# EAGLE design LB_BIT_i31_OSCILLATOR-v03(5_7)-OHW (EAGLE 6.6.0)
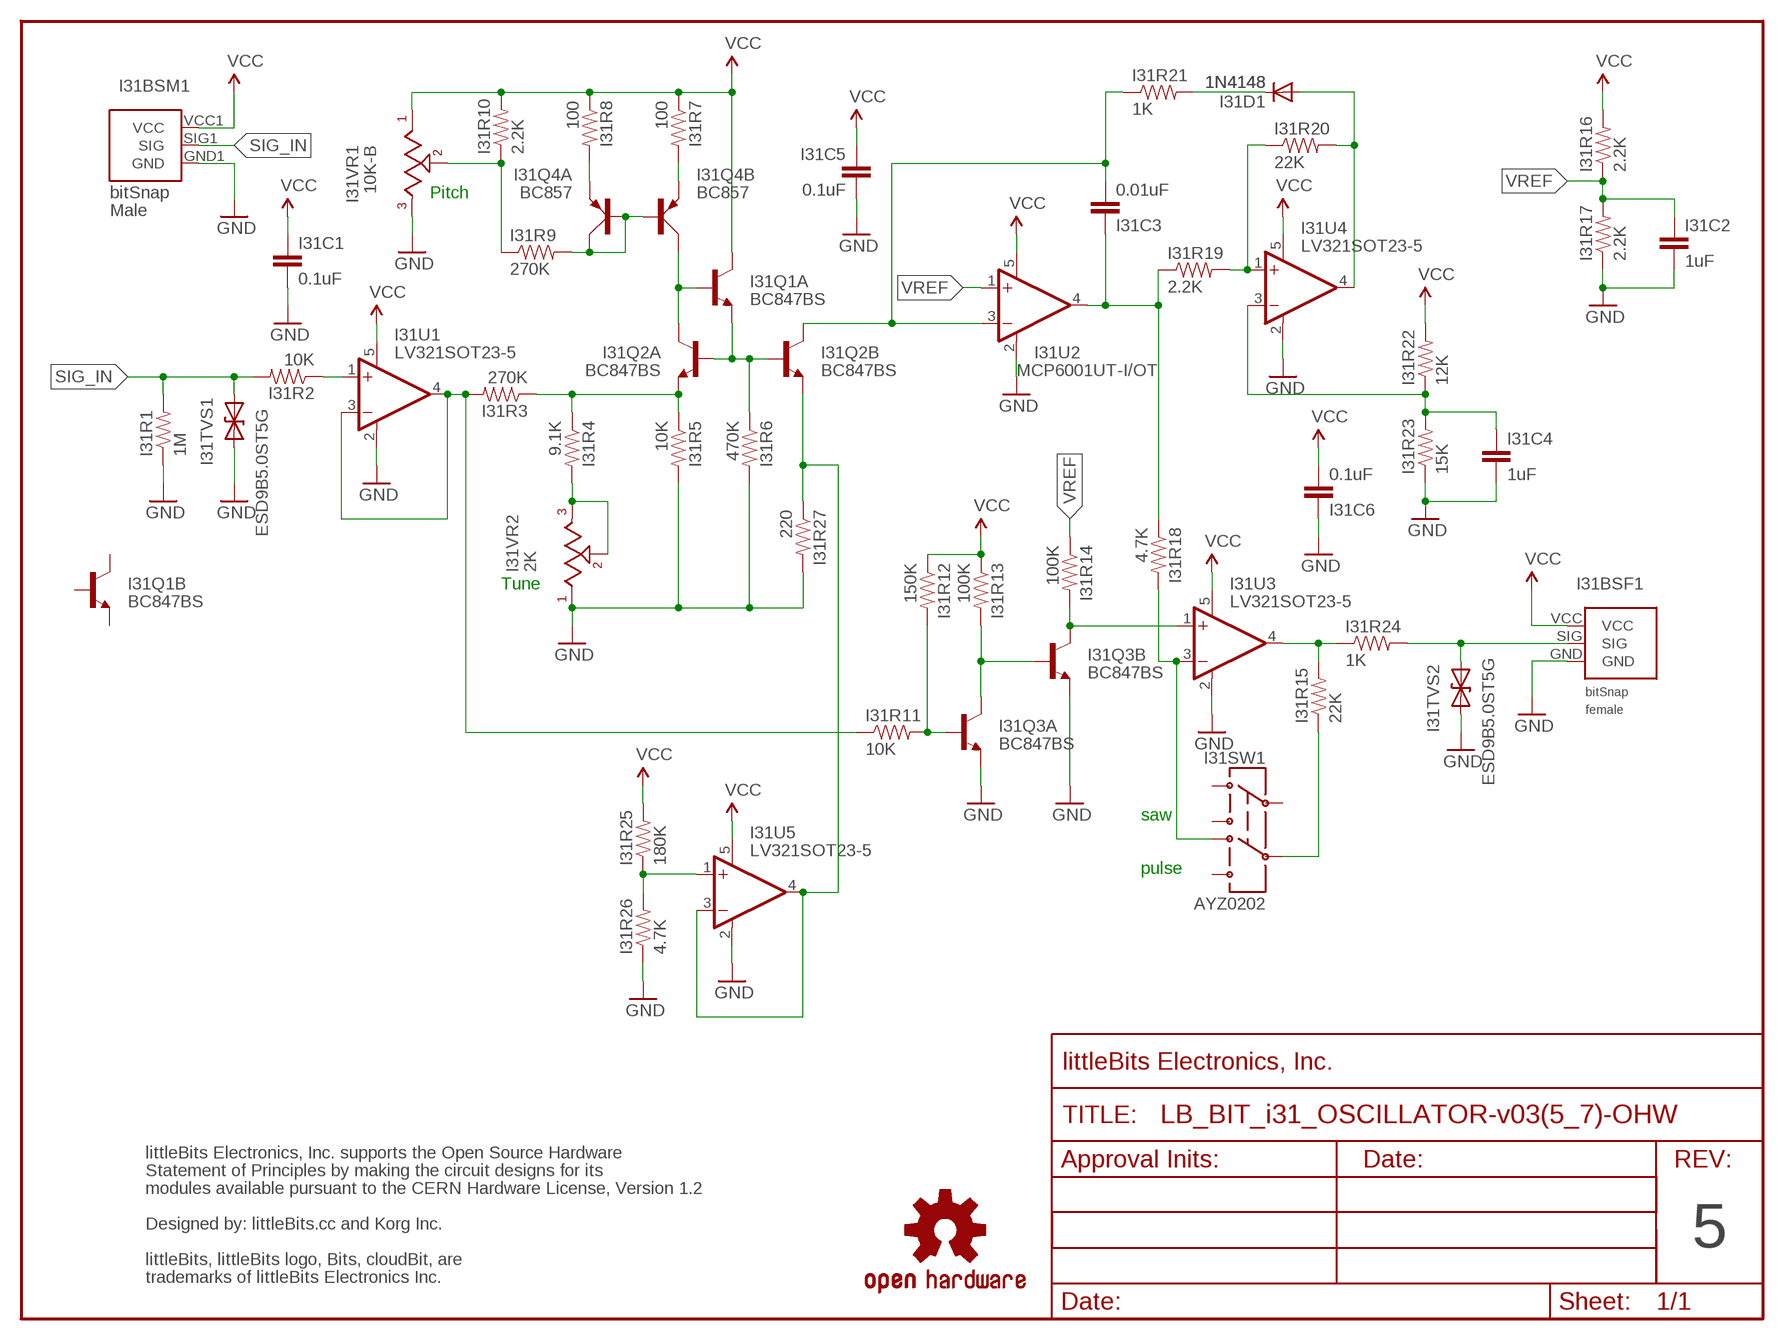
[diagram p0: schematic, sheet 1]

## Parts
I31BSF1  BITSNAP_V03_FEMALE  [BITSNAP_V03_FEMALE]
I31BSM1  BITSNAP_V03_MALE  [BITSNAP_V03_MALE]
I31C1  0.1uF  CAPCAP-0603  [CAP-0603]
I31C2  1uF  CAPCAP-0603  [CAP-0603]
I31C3  0.01uF  CAPCAP-0603  [CAP-0603]
I31C4  1uF  CAPCAP-0603  [CAP-0603]
I31C5  0.1uF  CAPCAP-0603  [CAP-0603]
I31C6  0.1uF  CAPCAP-0603  [CAP-0603]
I31D1  1N4148  DIODESOD  [SOD-323]
I31Q1  BC847BS  TRANS-BJT_NPN-DUAL-BC847BS  [SOT-363_PHILLIPS]
I31Q2  BC847BS  TRANS-BJT_NPN-DUAL-BC847BS  [SOT-363_PHILLIPS]
I31Q3  BC847BS  TRANS-BJT_NPN-DUAL-BC847BS  [SOT-363_PHILLIPS]
I31Q4  BC857  TRANS-BJT_PNP-DUALBC857  [SOT-363_PHILLIPS]
I31R1  1M  RESISTOR0603  [RES-0603]
I31R2  10K  RESISTOR0603  [RES-0603]
I31R3  270K  RESISTOR0603  [RES-0603]
I31R4  9.1K  RESISTOR0603  [RES-0603]
I31R5  10K  RESISTOR0603  [RES-0603]
I31R6  470K  RESISTOR0603  [RES-0603]
I31R7  100  RESISTOR0603  [RES-0603]
I31R8  100  RESISTOR0603  [RES-0603]
I31R9  270K  RESISTOR0603  [RES-0603]
I31R10  2.2K  RESISTOR0603  [RES-0603]
I31R11  10K  RESISTOR0603  [RES-0603]
I31R12  150K  RESISTOR0603  [RES-0603]
I31R13  100K  RESISTOR0603  [RES-0603]
I31R14  100K  RESISTOR0603  [RES-0603]
I31R15  22K  RESISTOR0603  [RES-0603]
I31R16  2.2K  RESISTOR0603  [RES-0603]
I31R17  2.2K  RESISTOR0603  [RES-0603]
I31R18  4.7K  RESISTOR0603  [RES-0603]
I31R19  2.2K  RESISTOR0603  [RES-0603]
I31R20  22K  RESISTOR0603  [RES-0603]
I31R21  1K  RESISTOR0603  [RES-0603]
I31R22  12K  RESISTOR0603  [RES-0603]
I31R23  15K  RESISTOR0603  [RES-0603]
I31R24  1K  RESISTOR0603  [RES-0603]
I31R25  180K  RESISTOR0603  [RES-0603]
I31R26  4.7K  RESISTOR0603  [RES-0603]
I31R27  220  RESISTOR0603  [RES-0603]
I31SW1  AYZ0202  [AYZ0202]
I31TVS1  ESD9B5.0ST5G  DIODE-TVSSOD-923  [SOD-923]
I31TVS2  ESD9B5.0ST5G  DIODE-TVSSOD-923  [SOD-923]
I31U1  LV321SOT23-5  [SOT23-5]
I31U2  MCP6001UT  LV321SOT23-5  [SOT23-5]
I31U3  LV321SOT23-5  [SOT23-5]
I31U4  LV321SOT23-5  [SOT23-5]
I31U5  LV321SOT23-5  [SOT23-5]
I31VR1  10K-B  ALPS_POTTH  [ALPS_POT]
I31VR2  2K  THUMBPOT-BOURNS_3352P  [THUMBPOT-BOURNS_3352]
U$2  FRAME-LETTER-OHWOHW  [FABDWG01-OHW]
U$3  OSHW-LOGOL  [OSHW-LOGO-L]
U$4  OSHWCREDIT-KORG  [OSHWCREDIT-KORG]

## Nets
GND: I31BSF1.GND I31BSM1.GND1(GND) I31C1.2 I31C2.2 I31C4.2 I31C5.2 I31C6.1 I31Q3.1(A:E) I31Q3.4(B:E) I31R1.1 I31R5.2 I31R6.2 I31R17.1 I31R23.1 I31R26.1 I31R27.2 I31TVS1.1(A) I31TVS2.1(A) I31U1.2(V-) I31U2.2(V-) I31U3.2(V-) I31U4.2(V-) I31U5.2(V-) I31VR1.3 I31VR2.3
N$1: I31R4.2 I31VR2.1 I31VR2.2
N$2: I31R3.2 I31R11.1 I31U1.3(-IN) I31U1.4(OUT)
N$3: I31Q1.2(A:B) I31Q2.6(A:C) I31Q4.3(B:C)
N$4: I31R2.1 I31U1.1(+IN)
N$5: I31Q1.1(A:E) I31Q2.2(A:B) I31Q2.5(B:B) I31R6.1
N$6: I31Q4.1(A:E) I31R8.2
N$7: I31Q4.4(B:E) I31R7.2
N$8: I31Q2.1(A:E) I31R3.1 I31R4.1 I31R5.1
N$9: I31R18.2 I31SW1.4 I31U3.3(-IN)
N$10: I31Q3.2(A:B) I31R11.2 I31R12.2
N$11: I31R19.2 I31R20.1 I31U4.1(+IN)
N$12: I31Q4.2(A:B) I31Q4.5(B:B) I31Q4.6(A:C) I31R9.2
N$13: I31R9.1 I31R10.1 I31VR1.2
N$14: I31Q3.5(B:B) I31Q3.6(A:C) I31R13.2
N$15: I31C3.1 I31R18.1 I31R19.1 I31U2.4(OUT)
N$16: I31Q3.3(B:C) I31R14.2 I31U3.1(+IN)
N$17: I31R15.1 I31SW1.5
N$18: I31C3.2 I31Q2.3(B:C) I31R21.1 I31U2.3(-IN)
N$19: I31D1.2(A) I31R20.2 I31U4.4(OUT)
N$20: I31D1.1(C) I31R21.2
N$21: I31R15.2 I31R24.1 I31U3.4(OUT)
N$22: I31C4.1 I31R22.1 I31R23.2 I31U4.3(-IN)
N$23: I31Q2.4(B:E) I31R27.1 I31U5.3(-IN) I31U5.4(OUT)
N$24: I31R25.1 I31R26.2 I31U5.1(+IN)
SIG_IN: I31BSM1.SIG1(SIG) I31R1.2 I31R2.2 I31TVS1.2(C)
SIG_OUT: I31BSF1.SIG I31R24.2 I31TVS2.2(C)
VCC: I31BSF1.VCC I31BSM1.VCC1(VCC) I31C1.1 I31C5.1 I31C6.2 I31Q1.6(A:C) I31R7.1 I31R8.1 I31R10.2 I31R12.1 I31R13.1 I31R16.2 I31R22.2 I31R25.2 I31U1.5(V+) I31U2.5(V+) I31U3.5(V+) I31U4.5(V+) I31U5.5(V+) I31VR1.1
VREF: I31C2.1 I31R14.1 I31R16.1 I31R17.2 I31U2.1(+IN)
Unconnected: I31Q1.3(B:C) I31Q1.4(B:E) I31Q1.5(B:B) I31SW1.1 I31SW1.2 I31SW1.3 I31SW1.6

## Notes on the sheet
- Pitch
- MCP6001UT-I/OT
- Tune
- saw
- pulse
- 5

## Library data of the parts
I31BSF1 = bitSnap:BITSNAP_V03_FEMALE
I31BSM1 = bitSnap:BITSNAP_V03_MALE
I31C1-I31C6 = LITTLEBITS:CAP
I31D1 = LITTLEBITS:DIODE: Diode These are standard reverse protection diodes and small signal diodes. SMA package can handle up to about 1A. SOD-323 can handle about 200mA. What the SOD-323 package when ordering, there are some mfgs out there that are 5-pin packages.
I31Q1-I31Q3 = LITTLEBITS:TRANS-BJT_NPN-DUAL
I31Q4 = LITTLEBITS:TRANS-BJT_PNP-DUAL
I31R1-I31R27 = LITTLEBITS:RESISTOR
I31SW1 = LITTLEBITS:AYZ0202
I31TVS1 I31TVS2 = LITTLEBITS:DIODE-TVS: Bidirectional Transient Voltage Suppression Diode: Device conducts in avalanche mode after reaching a part dependent voltage threshold. Used for limiting voltage spikes on ESD sensitive inputs and outputs.; IEC_ESD_PROT0: +/-18kV; LB_PN: ?; MPN: ESD9B5.0ST5G; V_CLAMP: ?; V_OPERATION: 5V
I31U1-I31U5 = LITTLEBITS:LV321
I31VR1 = LITTLEBITS:ALPS_POT
I31VR2 = LITTLEBITS:THUMBPOT-BOURNS_3352
U$2 = LITTLEBITS:FRAME-LETTER-OHW
U$3 = LITTLEBITS:OSHW-LOGO: Open Source Hardware Logo This logo indicates the piece of hardware it is found on incorporates a OSHW license and/or adheres to the definition of open source hardware found here: http://freedomdefined.org/OSHW
U$4 = LITTLEBITS:OSHWCREDIT-KORG

## Board
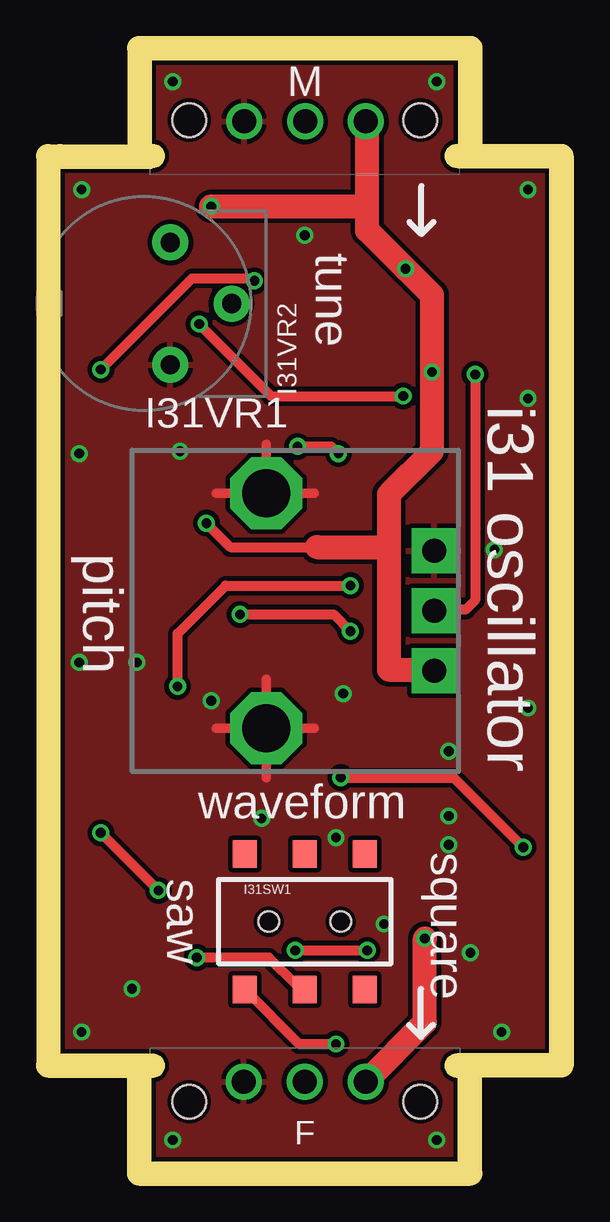
[diagram p1: board, top side]
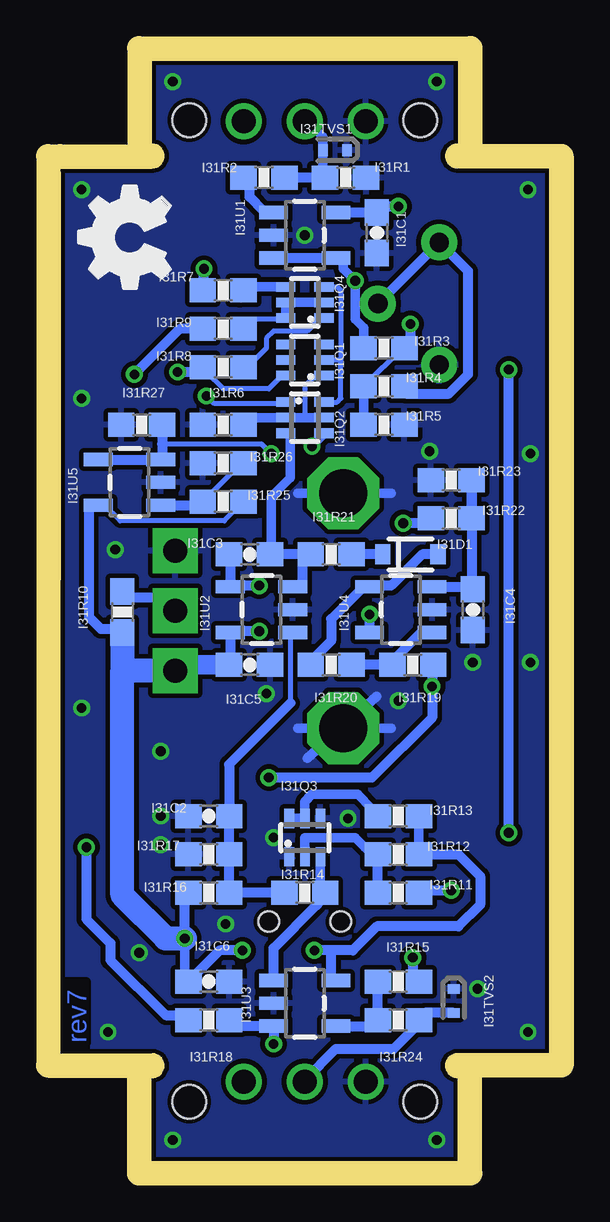
[diagram p2: board, bottom side, seen from below]

Size 20.4 x 45.9 mm. Coordinates in mm from the lower left corner, seen from the top.
Outline: 20.4,41.25 20.4,24.25
Outline: 0,4.5 0,41.4
Outline: 20.4,4.5 20.4,41.4
Copper layers (1*16): Top 0.035mm / dielectric 1.5mm / Bottom 0.035mm
Design rules "littleBitsDRC": minimum track width 0.2mm, minimum drill 0.4mm, track to track 0.2mm, track to pad 0.2mm, pad to pad 0.2mm, via to via 0.2mm, smd to smd 0mil, copper to edge 0.2mm, drill to drill 0.2mm, minimum pad ring 0.2mm, minimum via ring 0.15mm, stop-mask expansion 0.1mm, vias tented up to drill 0mil, thermal gap 0.2mm
Milling: 6 lines

### Footprints (pad centres in the part's own frame; a part is rotated, then mirrored left to right if it is on the bottom)
BITSNAP_V03_FEMALE = drill 1: GND 3.91,3.33; SIG 6.45,3.33; VCC 8.99,3.33 | hole 1.4: 1.63,2.5; 11.27,2.5
BITSNAP_V03_MALE = drill 1: GND1 8.98,2.56; SIG1 6.44,2.56; VCC1 3.9,2.56 | hole 1.4: 11.27,2.5; 1.63,2.5
CAP-0603 = smd 1.1 x 1: 1 -0.85,0; 2 0.85,0
SOD-323 = smd 0.63 x 0.83: 1 -1.15,0; 2 1.15,0
SOT-363_PHILLIPS = smd 0.4 x 0.8: 1 -0.65,-0.8; 2 0,-0.8; 3 0.65,-0.8; 4 0.65,0.8; 5 0,0.8; 6 -0.65,0.8
RES-0603 = smd 1.1 x 1: 1 -0.85,0; 2 0.85,0
AYZ0202 = smd 1 x 1.15: 1 -2.5,2.825; 2 0,2.825; 3 2.5,2.825; 4 -2.5,-2.825; 5 0,-2.825; 6 2.5,-2.825 | hole 0.85: 1.5,0; -1.5,0
SOD-923 = smd 0.4 x 0.5: 1 -0.5,0; 2 0.5,0
SOT23-5 = smd 0.55 x 1.2: 1 -0.95,-1.3; 2 0,-1.3; 3 0.95,-1.3; 4 0.95,1.3; 5 -0.95,1.3
ALPS_POT = drill 1 pad 1.88 square: 1 7,-2.5; 2 7,0; 3 7,2.5 | drill 2 octagon: LUG1 0,-4.9; LUG2 0,4.9
THUMBPOT-BOURNS_3352 = drill 0.8 pad 1.5: 1 2.55,-1.1; 2 0,-3.65; 3 -2.55,-1.1

### Placement (x,y rotation side)
I31BSF1  3.75,0 0 top
I31BSM1  16.65,45.9 180 top
I31C1  7.2,38.7 270 bottom
I31C2  14.2,14.4 180 bottom
I31C3  12.5,25.3 0 bottom
I31C4  3.2,23 270 bottom
I31C5  12.5,20.7 0 bottom
I31C6  14.2,7.5 180 bottom
I31D1  5.8,25.3 0 bottom
I31Q1  10.2,33.4 90 bottom
I31Q2  10.2,31 270 bottom
I31Q3  10.2,13.5 0 bottom
I31Q4  10.2,35.8 90 bottom
I31R1  8.5,41 180 bottom
I31R2  11.9,41 0 bottom
I31R3  6.9,33.9 180 bottom
I31R4  6.9,32.3 0 bottom
I31R5  6.9,30.7 0 bottom
I31R6  13.6,30.7 180 bottom
I31R7  13.6,36.3 0 bottom
I31R8  13.6,33.1 0 bottom
I31R9  13.6,34.7 0 bottom
I31R10  17.8,22.9 270 bottom
I31R11  6.3,11.2 180 bottom
I31R12  6.3,12.8 180 bottom
I31R13  6.3,14.4 180 bottom
I31R14  10.2,11.2 0 bottom
I31R15  6.3,7.5 180 bottom
I31R16  14.2,11.2 180 bottom
I31R17  14.2,12.8 0 bottom
I31R18  14.2,5.9 0 bottom
I31R19  5.7,20.7 180 bottom
I31R20  9.1,20.7 180 bottom
I31R21  9.1,25.3 0 bottom
I31R22  4.1,26.8 180 bottom
I31R23  4.1,28.4 0 bottom
I31R24  6.3,5.9 0 bottom
I31R25  13.6,27.5 0 bottom
I31R26  13.6,29.1 0 bottom
I31R27  17,30.7 180 bottom
I31SW1  10.2,10 0 top
I31TVS1  8.95,42.15 180 bottom
I31TVS2  4,6.7 270 bottom
I31U1  10.2,38.6 270 bottom
I31U2  12,23 90 bottom
I31U3  10.2,6.6 270 bottom
I31U4  6.2,23 90 bottom
I31U5  17.5,28.3 90 bottom
I31VR1  8.6,22.95 0 top
I31VR2  3.5,35.75 90 top
U$2  0,0 0 top
U$3  -27.55,-67.7 0 top  (outside the outline)
U$4  -72.6,-70.55 0 top  (outside the outline)
U$8  [OSHW_FILLX150_NOTEXT]  15.81,35.56 0 top

### Tracks (layer width: path | path; a pad name or v marks a point on that pad's centre or on a via)
GND  (via drill 0.41)
  Top 0.4: 6.5,18.05 10.6,18.05 | 8.6,16 8.6,20.1 | 6.5,27.85 10.6,27.85 | 8.6,26.6 8.6,29.9
  Bottom 0.4: 6.6,18.05 10.5,18.05 | 6.6,27.85 10.5,27.85 | 10.1,16.8 7.2,19.4
  other vias: 16.2,13.2 16.2,14.4 8.4,14.3 11.5,13.5 19.5,31.8 5,29.6 18.1,25.5 4.7,0.9 15.7,0.9 4.7,45 15.7,45 3.2,20.8 10.2,38.6 11.8,19.5 6.3,19.2 3,7.2 13.5,9.9 17.1,8.7 19.5,40.5 0.9,40.5 0.9,5.4 18.4,5.4 16.2,17.1 19.5,18.9 0.8,20.8 0.8,29.5
  pour Bottom: 0,0 0,45.9 20.4,45.9 20.4,0
  pour Top: 0,0 0,45.9 20.4,45.9 20.4,0
N$1
  Bottom 0.406: I31VR2.2 I31VR2.1 3.4,37.1 3.4,32.8 4.2,32 6,32 6.25,32.25 I31R4.2
N$2  (via drill 0.41)
  Top 0.406: v1.7,33 5.5,36.8 8,36.8 v8.1,36.7 | v4.1,11.3 v1.7,13.7
  Bottom 0.4: I31R3.2 7.75,34.75 8.1,35.1 v8.1,36.7 | 8.25,36.85 8.6,37.2 8.6,37.6 8.55,37.65
  Bottom 0.406: I31U1.3 I31U1.4 8.55,37.65 | v1.7,13.7 v1.7,33 | v8.1,36.7 8.25,36.85 | I31R11.1 5.35,11.3 v4.1,11.3
N$3
  Bottom 0.2: I31Q4.3 8.85,36.45 8.7,36.3 8.7,33.4 | 8.7,33.4 I31Q1.2 | I31Q2.6 8.85,31.65 8.7,31.8 8.7,33.4
N$4
  Bottom 0.406: I31U1.1 11.9,39.6 12.5,40.2 12.5,40.75 I31R2.1
N$5
  Bottom 0.2: I31Q1.1 9.75,32.75 10.2,32.3 10.2,31
  Bottom 0.4: I31Q2.5 10.2,31 I31Q2.2 12.45,31
  Bottom 0.406: 12.45,31 I31R6.1
N$6
  Bottom 0.2: I31Q4.1 9.4,35.1 9.6,35.1 10.1,34.6 11.5,34.6 11.8,34.3 11.8,33.9 12.5,33.2 I31R8.2
N$7
  Bottom 0.4: I31Q4.4 12.45,36.45 12.9,36 | 12.55,36.05 I31R7.2
  Bottom 0.406: 12.9,36 12.55,36.05
N$8  (via drill 0.41)
  Top 0.406: v14.3,31.9 8.8,31.9 v5.8,34.9
  Bottom 0.2: 6.15,33.9 I31R4.1 | 10.85,31.65 I31Q2.1 11.05,31.65 11.1,31.6 14,31.6 v14.3,31.9
  Bottom 0.4: I31R4.1 I31R5.1
  Bottom 0.406: 6.15,33.9 I31R3.1 5.8,33.95 v5.8,34.9
N$9  (via drill 0.41)
  Top 0.406: v11.5,4.9 9.97,4.9 I31SW1.4
  Bottom 0.406: I31R18.2 arc-90 13,5.65 I31U3.3 v11.5,4.9 | v11.5,4.9 arc-90 v11.5,4.9
N$10
  Bottom 0.4: I31Q3.2 10.2,13.5 8.1,13.5 7.7,13.1 7.4,12.8
  Bottom 0.406: I31R11.2 I31R12.2 7.4,12.8
N$11
  Bottom 0.406: I31R20.1 I31R19.2 6.55,20.85 6.1,21.3 5.35,22.05 I31U4.1
N$12
  Bottom 0.2: I31Q4.6 11.15,35.1 12.5,35.1 12.55,34.35 I31R9.2
  Bottom 0.4: I31Q4.2 I31Q4.5 I31Q4.6
N$13  (via drill 0.41)
  Top 0.406: v17.3,32.8 17.3,23.4 16.9,23 15.65,23 I31VR1.2
  Bottom 0.406: I31R10.1 17.65,23.75 17.4,23.5 15.6,23.5 I31VR1.2 | I31R9.1 15.4,34.7 v17.3,32.8
N$14
  Bottom 0.4: I31Q3.6 I31Q3.5 10.2,15 9.9,15.3 8,15.3 7.4,14.7
  Bottom 0.406: 7.4,14.7 7.15,14.45 I31R13.2
N$15  (via drill 0.41)
  Top 0.406: v4.9,19.8 4.9,22 6.9,24 v12.1,24 | v11.7,16 16.4,16 v19.3,13.1
  Bottom 0.406: 13.3,25.25 I31C3.1 13.3,25.35 | 13.3,25.25 | 13.3,25.25 I31U2.4 13.3,24 v12.1,24 | I31R19.1 4.85,20.55 4.9,20.5 v4.9,19.8 4.9,18.5 7.4,16 v11.7,16 | v19.3,13.1 19.3,10.1 18.3,9.1 18.3,8.4 16,6.1 15.3,6.1 I31R18.1
N$16
  Bottom 0.4: I31Q3.3 9.55,11.2
  Bottom 0.406: 9.55,11.2 I31R14.2 9.35,11.05 9.7,10.7 11.5,8.9 I31U3.1
N$17  (via drill 0.41)
  Top 0.406: I31SW1.5 9.9,7.3 8.7,8.5 v5.7,8.5
  Bottom 0.406: v5.7,8.5 5.7,7.7 | 5.7,7.6 5.7,7.7 | 5.7,7.7 5.45,7.65 I31R15.1
N$18
  Bottom 0.4: I31Q2.3 10.8,30.35 10.8,28.5 11.6,27.7 11.6,25.3
  Bottom 0.406: I31R21.1 10.3,25.3 | 10.3,25.3 I31C3.2 11.6,25.3 | 10.8,24 10.7,24 I31U2.3 10.3,23.95 10.3,25.3
N$19
  Bottom 0.406: I31D1.2 5.3,25.3 6.6,24 7.45,24 I31U4.4 7.75,23.95 9.1,22.6 9.1,21.7 9.6,21.2 9.95,20.85 I31R20.2
N$20
  Bottom 0.406: I31D1.1 I31R21.2
N$21
  Bottom 0.406: I31U3.4 7.4,5.65 arc-90 I31R24.1 I31R15.2
N$22
  Bottom 0.406: I31U4.3 3.3,23.95 I31C4.1 3.25,23.85 I31R23.2 I31R22.1
N$23  (via drill 0.41)
  Top 0.4: v9.9,29.8 11.3,29.8 v11.6,29.5
  Bottom 0.2: v11.6,29.5 12,29.9 16.15,29.9
  Bottom 0.4: I31Q2.4 9.4,30.3 v9.9,29.8
  Bottom 0.406: I31U5.4 I31U5.3 16.15,29.3 16.15,29.9 I31R27.1
N$24
  Bottom 0.2: 12.85,29.1 I31R25.1
  Bottom 0.406: I31U5.1 14.6,27.35 I31R25.1 | I31R26.2 12.85,29.1
SIG_IN
  Bottom 0.4: 10.2,43.45 9.45,42.7 I31TVS1.2 9.45,41
  Bottom 0.406: 10.2,43.45 I31BSM1.SIG1 | I31R1.2 9.45,41 I31R2.2
SIG_OUT
  Bottom 0.406: I31TVS2.2 5.15,6.2 arc-90 I31R24.2 5.45,5.75 5.9,5.3 6.5,4.7 6.9,4.7 8.9,4.7 10.2,3.4 I31BSF1.SIG
VCC  (via drill 0.41)
  Top 0.406: 12.8,43.34 I31BSM1.VCC1 | v7.5,22.8 11.4,22.8 v12.1,22.1 | 15,8.8 15,9.25 v15.2,9.3 | v6.1,26.6 7.1,25.6 10.7,25.6 | v9.8,8.8 v12.8,8.8
  Top 1: I31BSF1.VCC 15.2,5.8 v15.2,9.3 | v6.3,39.8 12.8,39.8 | 12.8,39.8 12.8,43.34 | 12.8,39.8 12.8,38.8 v14.4,37.2 15.5,36.1 v15.5,32.9 15.5,29.6 13.7,27.8 13.7,25.6 | 13.7,25.6 13.7,20.5 15.6,20.5 I31VR1.1 | 10.7,25.6 13.7,25.6
  Bottom 0.2: 11.15,32.75 11.7,32.2 13.6,32.2 14.3,32.9 14.45,32.95 | I31R25.2 13.55,26.7 17.9,26.7 18.55,27.35
  Bottom 0.4: I31R13.1 I31R12.1 | I31R16.2 15.2,11 | v15.2,9.3 15.2,7.7 I31C6.2 | I31Q1.6 11.15,32.75 | 14.45,32.95 I31R8.1
  Bottom 0.406: v15.2,9.3 15.2,11 | v6.3,39.8 6.95,39.8 I31C1.1 arc-90 7.3,39.55 I31U1.5 | I31R7.1 14.4,36.35 v14.4,37.2 | I31R8.1 14.65,32.9 v15.5,32.9 | I31U4.5 v7.5,22.8 | v7.5,22.8 | v12.1,22.1 12.8,22.1 I31U2.5 13.3,20.7 I31C5.1 13.4,20.7 | I31R12.1 3.8,12.8 2.9,11.9 2.9,10.7 3.8,9.8 7.2,9.8 8.2,8.8 9.1,8.8 | 9.1,8.8 v9.8,8.8 | I31U3.5 9.1,7.75 9.1,8.8 | I31R22.2 5.15,26.6 v6.1,26.6 | v12.8,8.8 13.75,8.8 I31C6.2 | 17.8,20.45 17.8,20.5 | I31R10.2 17.8,22.2 18.7,22.2 19.2,22.7 19.2,27.35 I31U5.5 18.55,27.35
  Bottom 0.813: 13.4,20.7 15.55,20.7 I31VR1.1
  Bottom 1: v15.2,9.3 16,9.3 17.8,11.1 17.8,20.5 I31R10.2 | I31VR1.1 17.8,20.45
VREF
  Bottom 0.2: 10.8,21.95 10.8,19.1
  Bottom 0.406: I31R14.1 I31R16.1 I31R17.2 I31C2.1 13.35,16.55 10.8,19.1 | I31U2.1 10.8,21.95

### Text on the board
Bottom: rev7
tPlace: tune | i31 oscillator | pitch | waveform | square | saw
Reference: XLARGE
dxf: I31BSM1 (Pink) | I31BSF1 (Pink) | 7